# EAGLE schematic transducerVIS (EAGLE 8.5.1)
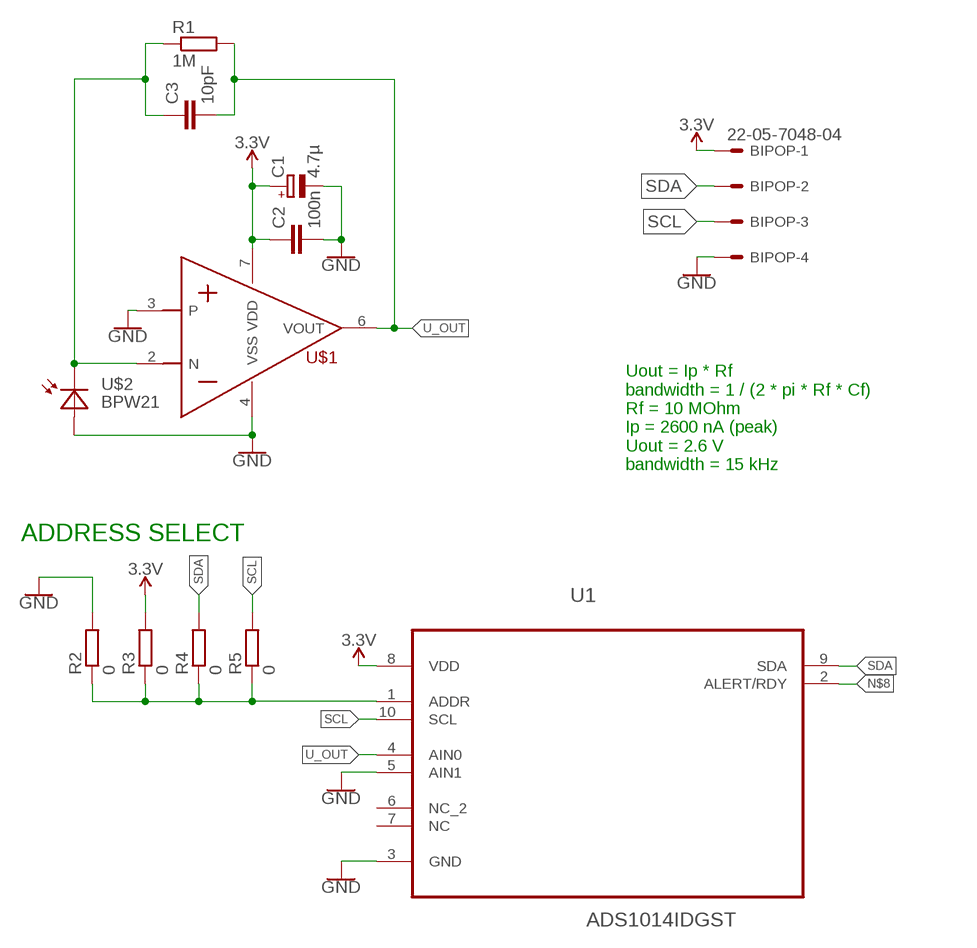
[diagram p0: schematic, sheet 1]

## Parts
BIPOP  22-05-7048-04  [7395-04]
C1  4.7µ  CPOL-EUA/3216-18R  [A/3216-18R]
C2  100n  C-EUC0805  [C0805]
C3  10pF  C-EUC0603  [C0603]
R1  1M  R-EU_R0805  [R0805]
R2  0  R-EU_R0805  [R0805]
R3  0  R-EU_R0805  [R0805]
R4  0  R-EU_R0805  [R0805]
R5  0  R-EU_R0805  [R0805]
U1  ADS1014IDGST  [SOP50P490X110-10N]
U$1  LMC6001  [DIL08]
U$2  BPW21  [TO52]

## Nets
3.3V: BIPOP.1 C1.+ C2.1 R3.2 U1.8(VDD) U$1.7(VDD)
GND: BIPOP.4 C1.- C2.2 R2.2 U1.3(GND) U1.5(AIN1) U$1.3(P) U$1.4(VSS) U$2.1(A)
N$3: R2.1 R3.1 R4.1 R5.1 U1.1(ADDR)
N$5: C3.1 R1.1 U$1.2(N) U$2.2(C)
N$8: U1.2(ALERT/RDY)
SCL: BIPOP.3 R5.2 U1.10(SCL)
SDA: BIPOP.2 R4.2 U1.9(SDA)
U_OUT: C3.2 R1.2 U1.4(AIN0) U$1.6(VOUT)
Unconnected: U1.6(NC_2) U1.7(NC)

## Notes on the sheet
- Uout = Ip * Rf
  bandwidth = 1 / (2 * pi * Rf * Cf)
  Rf = 10 MOhm
  Ip = 2600 nA (peak)
  Uout = 2.6 V
  bandwidth = 15 kHz
- ADDRESS SELECT

## Library data of the parts
BIPOP = EP_molex_6410_7395:22-?-04: CONNECTOR wire to board 2.54 mm (.1 inch) pitch header
C1 = rcl:CPOL-EU: POLARIZED CAPACITOR, European symbol; SPICEPREFIX: C
C2 = resistor:C-EU: CAPACITOR, European symbol
C3 = rcl:C-EU: CAPACITOR, European symbol; SPICEPREFIX: C
R1-R5 = rcl:R-EU_: RESISTOR, European symbol; SPICEPREFIX: R
U1 = Texas Instruments_By_element14_Batch_1:ADS1014IDGST: Ultra-Small, Low-Power, 12-Bit Analog-to-Digital Converter with Internal Reference; MPN: ADS1014IDGST; OC_FARNELL: 1778210; OC_NEWARK: 35R0210; PACKAGE: MSOP-10; SUPPLIER: Texas Instruments
U$1 = customy:LMC6001: Operational amplifier for photometric applications.
U$2 = customy:BPW21